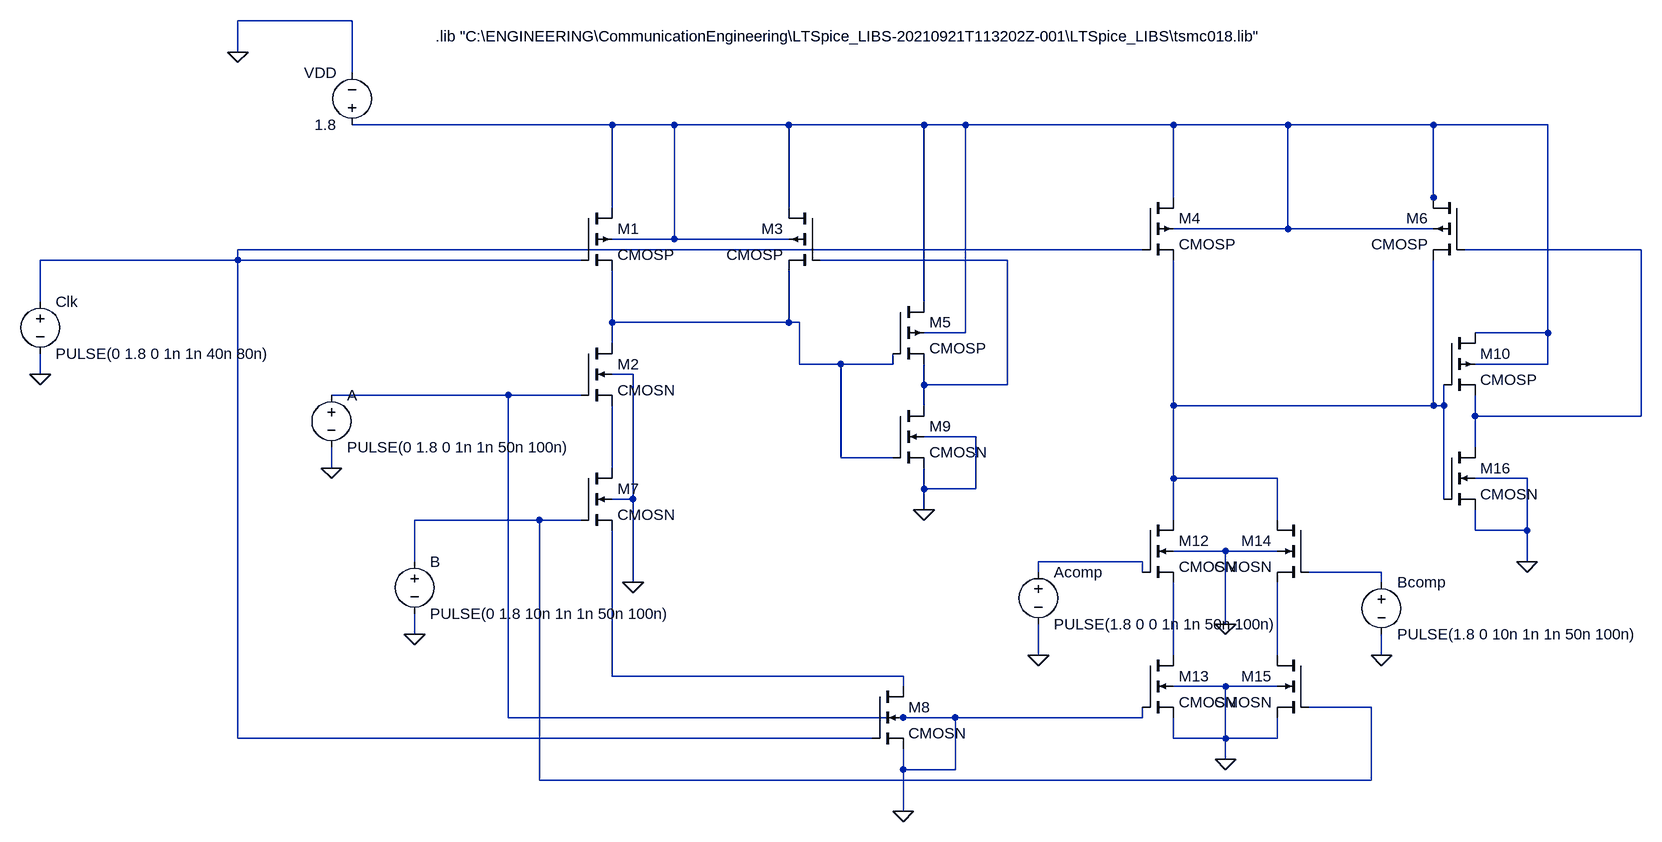
[diagram p0: schematic Draft1.asc]
Draft1.asc, the LTspice schematic file:
Version 4
SHEET 1 1956 1172
WIRE -48 -64 -224 -64
WIRE -224 -16 -224 -64
WIRE -48 16 -48 -64
WIRE 352 96 -48 96
WIRE 448 96 352 96
WIRE 624 96 448 96
WIRE 832 96 624 96
WIRE 896 96 832 96
WIRE 1216 96 896 96
WIRE 1392 96 1216 96
WIRE 1616 96 1392 96
WIRE 1792 96 1616 96
WIRE 1216 208 1216 96
WIRE 1616 208 1616 96
WIRE 352 224 352 96
WIRE 624 224 624 96
WIRE 1616 224 1616 208
WIRE 1392 256 1392 96
WIRE 1392 256 1216 256
WIRE 1616 256 1392 256
WIRE 448 272 448 96
WIRE 448 272 352 272
WIRE 624 272 448 272
WIRE 1168 288 -224 288
WIRE 1936 288 1664 288
WIRE -224 304 -224 288
WIRE -224 304 -528 304
WIRE 304 304 -224 304
WIRE 960 304 672 304
WIRE -528 368 -528 304
WIRE 832 368 832 96
WIRE 352 400 352 320
WIRE 624 400 624 320
WIRE 624 400 352 400
WIRE 640 400 624 400
WIRE 896 416 896 96
WIRE 896 416 832 416
WIRE 1792 416 1792 96
WIRE 1792 416 1680 416
WIRE 352 432 352 400
WIRE 640 464 640 400
WIRE 704 464 640 464
WIRE 784 464 784 448
WIRE 784 464 704 464
WIRE 1792 464 1792 416
WIRE 1792 464 1680 464
WIRE -528 480 -528 448
WIRE 384 480 352 480
WIRE 832 496 832 464
WIRE 960 496 960 304
WIRE 960 496 832 496
WIRE 192 512 -80 512
WIRE 304 512 192 512
WIRE 832 528 832 496
WIRE 1216 528 1216 304
WIRE 1616 528 1616 304
WIRE 1616 528 1216 528
WIRE 1632 528 1632 496
WIRE 1632 528 1616 528
WIRE 1680 544 1680 512
WIRE 1936 544 1936 288
WIRE 1936 544 1680 544
WIRE 912 576 832 576
WIRE 1680 592 1680 544
WIRE 704 608 704 464
WIRE 784 608 704 608
WIRE -80 624 -80 592
WIRE 352 624 352 528
WIRE 1216 640 1216 528
WIRE 1376 640 1216 640
WIRE 1760 640 1680 640
WIRE 832 656 832 624
WIRE 912 656 912 576
WIRE 912 656 832 656
WIRE 384 672 384 480
WIRE 384 672 352 672
WIRE 1632 672 1632 528
WIRE 832 688 832 656
WIRE 240 704 48 704
WIRE 304 704 240 704
WIRE 1216 704 1216 640
WIRE 1376 704 1376 640
WIRE 1680 720 1680 688
WIRE 1760 720 1760 640
WIRE 1760 720 1680 720
WIRE 1296 752 1216 752
WIRE 1376 752 1296 752
WIRE 48 768 48 704
WIRE 1168 768 1008 768
WIRE 1760 768 1760 720
WIRE 1008 784 1008 768
WIRE 1168 784 1168 768
WIRE 1536 784 1424 784
WIRE 384 800 384 672
WIRE 1536 800 1536 784
WIRE 1296 864 1296 752
WIRE 48 880 48 848
WIRE 1008 912 1008 864
WIRE 1216 912 1216 800
WIRE 1376 912 1376 800
WIRE 1536 912 1536 880
WIRE 352 944 352 720
WIRE 800 944 352 944
WIRE 800 960 800 944
WIRE 1296 960 1216 960
WIRE 1376 960 1296 960
WIRE 1520 992 1424 992
WIRE 192 1008 192 512
WIRE 800 1008 192 1008
WIRE 880 1008 800 1008
WIRE 1168 1008 1168 992
WIRE 1168 1008 880 1008
WIRE -224 1040 -224 304
WIRE 752 1040 -224 1040
WIRE 1216 1040 1216 1008
WIRE 1296 1040 1296 960
WIRE 1296 1040 1216 1040
WIRE 1376 1040 1376 1008
WIRE 1376 1040 1296 1040
WIRE 1296 1072 1296 1040
WIRE 800 1088 800 1056
WIRE 880 1088 880 1008
WIRE 880 1088 800 1088
WIRE 240 1104 240 704
WIRE 1520 1104 1520 992
WIRE 1520 1104 240 1104
WIRE 800 1152 800 1088
FLAG -224 -16 0
FLAG -528 480 0
FLAG -80 624 0
FLAG 48 880 0
FLAG 800 1152 0
FLAG 384 800 0
FLAG 832 688 0
FLAG 1296 864 0
FLAG 1296 1072 0
FLAG 1760 768 0
FLAG 1008 912 0
FLAG 1536 912 0
SYMBOL pmos4 304 224 R0
SYMATTR InstName M1
SYMATTR Value CMOSP
SYMATTR Value2 l=180n w=220n
SYMBOL nmos4 304 432 R0
SYMATTR InstName M2
SYMATTR Value CMOSN
SYMATTR Value2 l=180n w=220n
SYMBOL pmos4 672 224 M0
SYMATTR InstName M3
SYMATTR Value CMOSP
SYMATTR Value2 l=180n w=220n
SYMBOL pmos4 1168 208 R0
SYMATTR InstName M4
SYMATTR Value CMOSP
SYMATTR Value2 l=180n w=220n
SYMBOL pmos4 784 368 R0
SYMATTR InstName M5
SYMATTR Value CMOSP
SYMATTR Value2 l=180n w=220n
SYMBOL pmos4 1664 208 M0
SYMATTR InstName M6
SYMATTR Value CMOSP
SYMATTR Value2 l=180n w=220n
SYMBOL nmos4 304 624 R0
SYMATTR InstName M7
SYMATTR Value CMOSN
SYMATTR Value2 l=180n w=220n
SYMBOL nmos4 752 960 R0
SYMATTR InstName M8
SYMATTR Value CMOSN
SYMATTR Value2 l=180n w=220n
SYMBOL nmos4 784 528 R0
SYMATTR InstName M9
SYMATTR Value CMOSN
SYMATTR Value2 l=180n w=220n
SYMBOL voltage -48 112 R180
WINDOW 0 24 96 Left 2
WINDOW 3 24 16 Left 2
WINDOW 123 0 0 Left 0
WINDOW 39 0 0 Left 0
SYMATTR InstName VDD
SYMATTR Value 1.8
SYMBOL voltage -80 496 R0
WINDOW 123 0 0 Left 0
WINDOW 39 0 0 Left 0
SYMATTR InstName A
SYMATTR Value PULSE(0 1.8 0 1n 1n 50n 100n)
SYMBOL voltage 48 752 R0
WINDOW 123 0 0 Left 0
WINDOW 39 0 0 Left 0
SYMATTR InstName B
SYMATTR Value PULSE(0 1.8 10n 1n 1n 50n 100n)
SYMBOL voltage -528 352 R0
WINDOW 123 0 0 Left 0
WINDOW 39 0 0 Left 0
SYMATTR InstName Clk
SYMATTR Value PULSE(0 1.8 0 1n 1n 40n 80n)
SYMBOL pmos4 1632 416 R0
SYMATTR InstName M10
SYMATTR Value CMOSP
SYMATTR Value2 l=180n w=220n
SYMBOL nmos4 1168 704 R0
SYMATTR InstName M12
SYMATTR Value CMOSN
SYMATTR Value2 l=180n w=220n
SYMBOL nmos4 1168 912 R0
SYMATTR InstName M13
SYMATTR Value CMOSN
SYMATTR Value2 l=180n w=220n
SYMBOL nmos4 1424 704 M0
SYMATTR InstName M14
SYMATTR Value CMOSN
SYMATTR Value2 l=180n w=220n
SYMBOL nmos4 1424 912 M0
SYMATTR InstName M15
SYMATTR Value CMOSN
SYMATTR Value2 l=180n w=220n
SYMBOL nmos4 1632 592 R0
SYMATTR InstName M16
SYMATTR Value CMOSN
SYMATTR Value2 l=180n w=220n
SYMBOL voltage 1008 768 R0
WINDOW 123 0 0 Left 0
WINDOW 39 0 0 Left 0
SYMATTR InstName Acomp
SYMATTR Value PULSE(1.8 0 0 1n 1n 50n 100n)
SYMBOL voltage 1536 784 R0
WINDOW 123 0 0 Left 0
WINDOW 39 0 0 Left 0
SYMATTR InstName Bcomp
SYMATTR Value PULSE(1.8 0 10n 1n 1n 50n 100n)
TEXT 80 -40 Left 2 !.lib "C:\\ENGINEERING\\CommunicationEngineering\\LTSpice_LIBS-20210921T113202Z-001\\LTSpice_LIBS\\tsmc018.lib"

The netlist it stands for:
* Draft1.asc
M1 N001 N002 N005 N001 CMOSP l=180n w=220n
M2 N005 0 N007 0 CMOSN l=180n w=220n
M3 N001 N004 N005 N001 CMOSP l=180n w=220n
M4 N001 N002 N006 N001 CMOSP l=180n w=220n
M5 N001 N005 N004 N001 CMOSP l=180n w=220n
M6 N001 N003 N006 N001 CMOSP l=180n w=220n
M7 N007 N008 N013 0 CMOSN l=180n w=220n
M8 N013 N002 0 0 CMOSN l=180n w=220n
M9 N004 N005 0 0 CMOSN l=180n w=220n
VDD N001 0 1.8
V§A 0 0 PULSE(0 1.8 0 1n 1n 50n 100n)
V§B N008 0 PULSE(0 1.8 10n 1n 1n 50n 100n)
V§Clk N002 0 PULSE(0 1.8 0 1n 1n 40n 80n)
M10 N001 N006 N003 N001 CMOSP l=180n w=220n
M12 N006 N009 N011 0 CMOSN l=180n w=220n
M13 N011 0 0 0 CMOSN l=180n w=220n
M14 N006 N010 N012 0 CMOSN l=180n w=220n
M15 N012 N008 0 0 CMOSN l=180n w=220n
M16 N003 N006 0 0 CMOSN l=180n w=220n
V§Acomp N009 0 PULSE(1.8 0 0 1n 1n 50n 100n)
V§Bcomp N010 0 PULSE(1.8 0 10n 1n 1n 50n 100n)
.model NMOS NMOS
.model PMOS PMOS
.lib standard.mos
.lib "C:\ENGINEERING\CommunicationEngineering\LTSpice_LIBS-20210921T113202Z-001\LTSpice_LIBS\tsmc018.lib"
.backanno
.end